# EAGLE schematic Encoder (EAGLE 9.6.2)
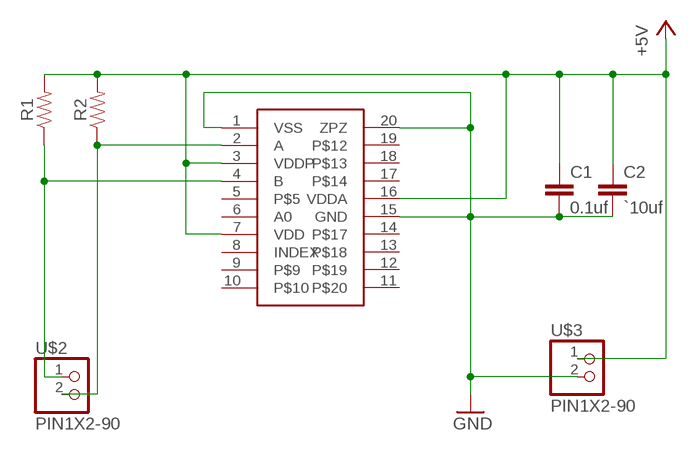
[diagram p0: schematic, sheet 1]

## Parts
C1  0.1uf  CAP-0805  [0805]
C2  `10uf  CAP-0805  [0805]
R1  RESISTOR0805  [0805]
R2  RESISTOR0805  [0805]
U$1  AS5304  [SSOP20]
U$2  PIN1X2-90  [1X02/90]
U$3  PIN1X2-90  [1X02/90]

## Nets
+5V: C1.1 C2.1 R1.2 R2.2 U$1.3(VDDP) U$1.7(VDD) U$1.16(VDDA) U$3.1
GND: C1.2 C2.2 U$1.1(VSS) U$1.15(GND) U$1.20(ZPZ) U$3.2
N$2: R2.1 U$1.2(A) U$2.2
N$3: R1.1 U$1.4(B) U$2.1
Unconnected: U$1.5 U$1.6(A0) U$1.8(INDEX) U$1.9 U$1.10 U$1.11 U$1.12 U$1.13 U$1.14 U$1.17 U$1.18 U$1.19

## Library data of the parts
C1 C2 = SparkFun-Capacitors:CAP
R1 R2 = SparkFun-Resistors:RESISTOR: Generic Resistor Package
U$1 = MouseLib:AS5304
U$2 U$3 = MouseLib:PIN1X2-90